# Altium schematic sheet S-SSHI.SchDoc
size A4
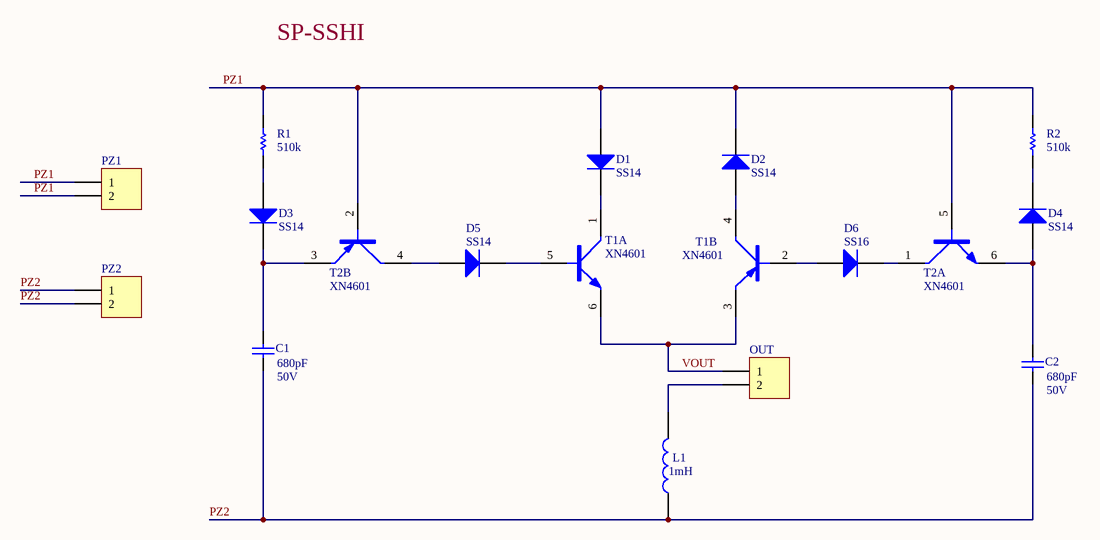
[diagram p0: S-SSHI.SchDoc]

## Parts
C1  value 680pF  Nominal Voltage: 50V  [6-0805_N]  (hidden comment: CAP)
C2  value 680pF  Nominal Voltage: 50V  [6-0805_N]  (hidden comment: CAP)
D1  SS14  [SMD SS16]
D2  SS14  [SMD SS16]
D3  SS14  [SMD SS16]
D4  SS14  [SMD SS16]
D5  SS14  [SMD SS16]
D6  SS16  [SMD SS16]
L1  1mH  [1812]
OUT  Header 2  [HDR1X2]  (value not drawn)
PZ1  Header 2  [HDR1X2]  (value not drawn)
PZ2  Header 2  [HDR1X2]  (value not drawn)
R1  value 510k  [6-0805_N]  (hidden comment: Res1)
R2  value 510k  [6-0805_N]  (hidden comment: Res1)
T1  XN4601  [XN4601]  (parts A,B of 2)
T2  XN4601  [XN4601]  (parts A,B of 2)

## Nets
PZ1: D1.1(A) D2.2(K) PZ1.1 PZ1.2 R1.2 R2.2 T2.2(PNP_B) T2.5(NPN_B)
PZ2: C1.1 C2.1 L1.1 PZ2.1 PZ2.2
VOUT: OUT.1 T1.3(PNP_E) T1.6(NPN_E)
NetC1_2: C1.2 D3.2(K) T2.3(PNP_E)
NetC2_2: C2.2 D4.1(A) T2.6(NPN_E)
NetD1_2: D1.2(K) T1.1(NPN_C)
NetD2_1: D2.1(A) T1.4(PNP_C)
NetD3_1: D3.1(A) R1.1
NetD4_2: D4.2(K) R2.1
NetD5_1: D5.1(A) T2.4(PNP_C)
NetD5_2: D5.2(K) T1.5(NPN_B)
NetD6_1: D6.1(A) T1.2(PNP_B)
NetD6_2: D6.2(K) T2.1(NPN_C)
NetL1_2: L1.2 OUT.2

## Notes on the sheet
- SP-SSHI

## Library data of the parts
C1 C2 = CAP: Capacitor; Published: 8-Jun-2000; LatestRevisionDate: 17-Jul-2002; LatestRevisionNote: Re-released for DXP Platform.; PackageReference: RAD-0.3; Publisher: Altium Limited
D1-D6 = Diode 1N4004: 1 Amp General Purpose Rectifier; Published: 8-Jun-2000; LatestRevisionDate: 17-Jul-2002; LatestRevisionNote: Re-released for DXP Platform.; DatasheetDocument: 1998; PackageDocument: Aug-1999; PackageReference: DO-41; Publisher: Altium Limited; Code_JEDEC: DO-204-AL; ComponentLink1Description: Manufacturer Link; ComponentLink1URL: http://www.fairchildsemi.com/; ComponentLink2Description: Datasheet; ComponentLink2URL: http://www.fairchildsemi.com/ds/1N%2F1N4001.pdf
L1 = INDUCTOR
OUT PZ1 PZ2 = Header 2: Header, 2-Pin; LatestRevisionDate: 17-Jul-2002; LatestRevisionNote: Re-released for DXP Platform.; Publisher: Altium Limited
R1 R2 = Res1: Resistor; Published: 8-Jun-2000; LatestRevisionDate: 17-Jul-2002; LatestRevisionNote: Re-released for DXP Platform.; PackageReference: AXIAL-0.3; Publisher: Altium Limited; PackageDescription: Axial Device, Thru-Hole; 2 Leads; 0.3 in Pin Spacing
T1 T2 = XN4601: Composite Transistors